# Altium project DISPLAY.PrjPcb
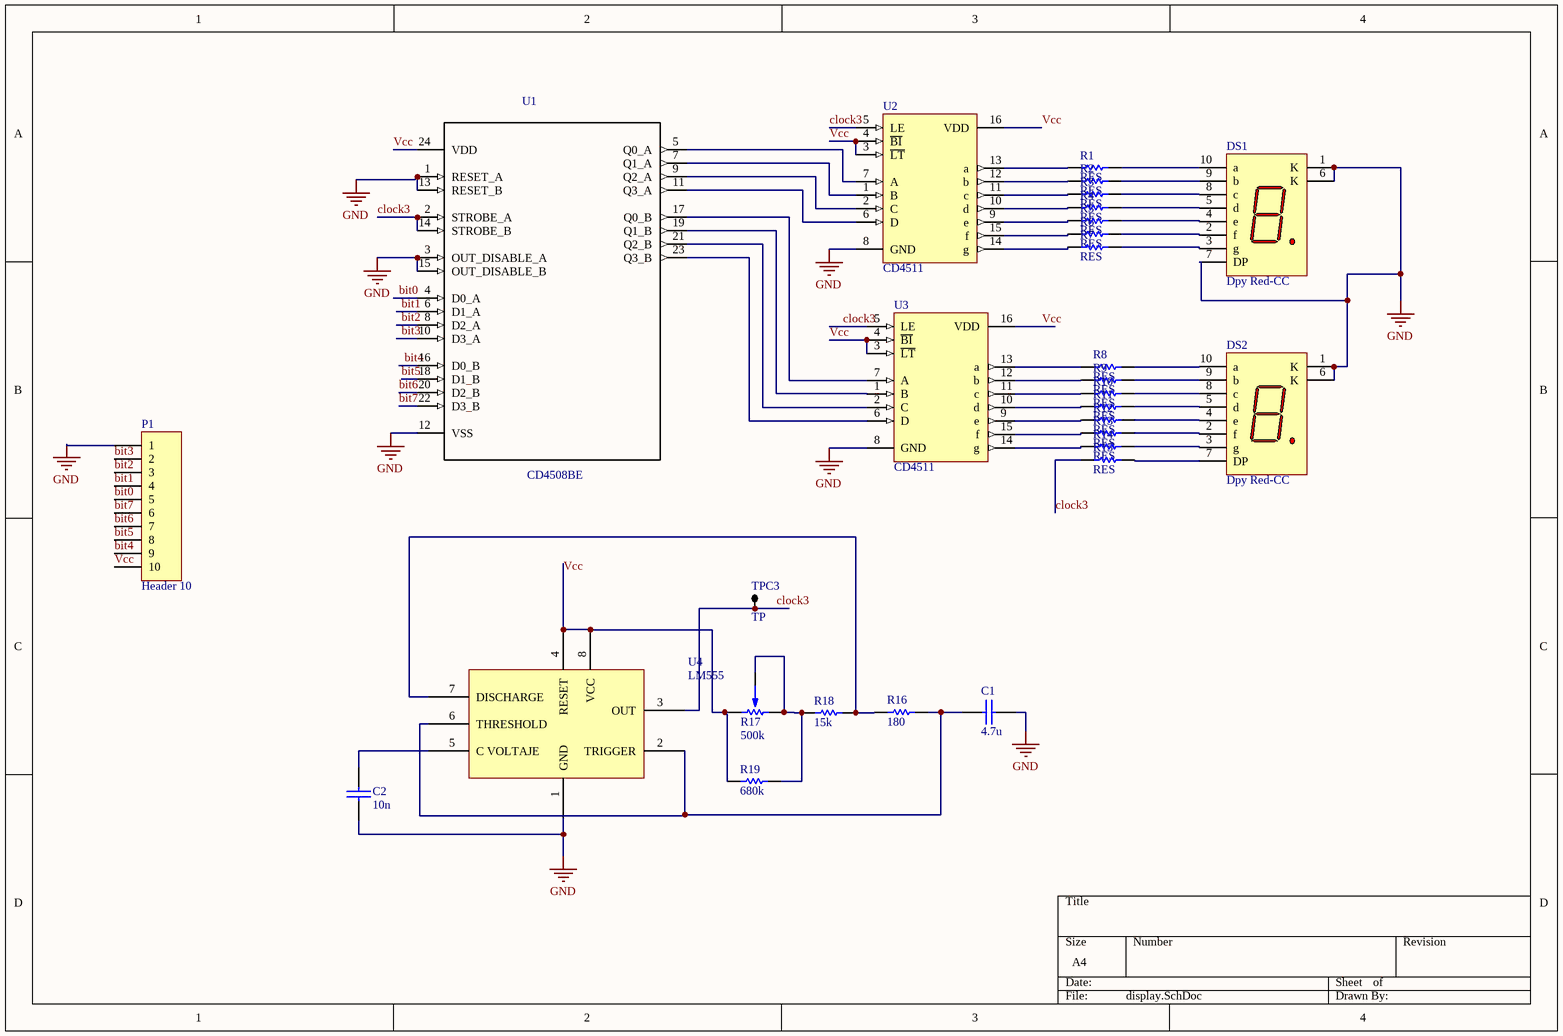
[diagram p0: display.SchDoc]
1 sheet, 29 parts. Net scope: global (net labels, ports and power ports of the same name join across sheets).
Board file: display.PcbDoc

## Sheet display.SchDoc
size A4

### Parts
C1  4.7u  [0805]
C2  10n  [CAP200]
DS1  Dpy Red-CC  [A]
DS2  Dpy Red-CC  [A]
P1  Header 10  [HDR1X10]
R1  RES  [0805]
R2  RES  [0805]
R3  RES  [0805]
R4  RES  [0805]
R5  RES  [0805]
R6  RES  [0805]
R7  RES  [0805]
R8  RES  [0805]
R9  RES  [0805]
R10  RES  [0805]
R11  RES  [0805]
R12  RES  [0805]
R13  RES  [0805]
R14  RES  [0805]
R15  RES  [0805]
R16  180  [0805]
R17  500k  [POTENCIOMETRO]
R18  15k  [0805]
R19  680k  [RES400]
TPC3  TP  [TPTH]
U1  CD4508BE  [*DIP254P1080X508-24]
U2  CD4511  [DIP16]
U3  CD4511  [DIP16]
U4  LM555  [DIP8]

### Nets
GND: C1.2 C2.1 DS1.1(K) DS1.6(K) DS1.7(DP) DS2.1(K) DS2.6(K) P1.1 U1.1(RESET_A) U1.3(OUT_DISABLE_A) U1.12(VSS) U1.13(RESET_B) U1.15(OUT_DISABLE_B) U2.8(GND) U3.8(GND) U4.1(GND)
bit0: P1.5 U1.4(D0_A)
bit1: P1.4 U1.6(D1_A)
bit2: P1.3 U1.8(D2_A)
bit3: P1.2 U1.10(D3_A)
bit4: P1.9 U1.16(D0_B)
bit5: P1.8 U1.18(D1_B)
bit6: P1.7 U1.20(D2_B)
bit7: P1.6 U1.22(D3_B)
clock3: R15.1 TPC3.1 U1.2(STROBE_A) U1.14(STROBE_B) U2.5(LE) U3.5(LE) U4.3(OUT)
Vcc: P1.10 R17.1 R19.1 U1.24(VDD) U2.3(~{LT}) U2.4(~{BI}) U2.16(VDD) U3.3(~{LT}) U3.4(~{BI}) U3.16(VDD) U4.4(RESET) U4.8(VCC)
NetC1_1: C1.1 R16.2 U4.2(TRIGGER) U4.6(THRESHOLD)
NetC2_2: C2.2 U4.5(C_VOLTAJE)
NetDS1_2: DS1.2(f) R6.2
NetDS1_3: DS1.3(g) R7.2
NetDS1_4: DS1.4(e) R5.2
NetDS1_5: DS1.5(d) R4.2
NetDS1_8: DS1.8(c) R3.2
NetDS1_9: DS1.9(b) R2.2
NetDS1_10: DS1.10(a) R1.2
NetDS2_2: DS2.2(f) R13.2
NetDS2_3: DS2.3(g) R14.2
NetDS2_4: DS2.4(e) R12.2
NetDS2_5: DS2.5(d) R11.2
NetDS2_7: DS2.7(DP) R15.2
NetDS2_8: DS2.8(c) R10.2
NetDS2_9: DS2.9(b) R9.2
NetDS2_10: DS2.10(a) R8.2
NetR1_1: R1.1 U2.13(a)
NetR2_1: R2.1 U2.12(b)
NetR3_1: R3.1 U2.11(c)
NetR4_1: R4.1 U2.10(d)
NetR5_1: R5.1 U2.9(e)
NetR6_1: R6.1 U2.15(f)
NetR7_1: R7.1 U2.14(g)
NetR8_1: R8.1 U3.13(a)
NetR9_1: R9.1 U3.12(b)
NetR10_1: R10.1 U3.11(c)
NetR11_1: R11.1 U3.10(d)
NetR12_1: R12.1 U3.9(e)
NetR13_1: R13.1 U3.15(f)
NetR14_1: R14.1 U3.14(g)
NetR16_1: R16.1 R18.2 U4.7(DISCHARGE)
NetR17_2: R17.2 R17.3 R18.1 R19.2
NetU1_5: U1.5(Q0_A) U2.7(A)
NetU1_7: U1.7(Q1_A) U2.1(B)
NetU1_9: U1.9(Q2_A) U2.2(C)
NetU1_11: U1.11(Q3_A) U2.6(D)
NetU1_17: U1.17(Q0_B) U3.7(A)
NetU1_19: U1.19(Q1_B) U3.1(B)
NetU1_21: U1.21(Q2_B) U3.2(C)
NetU1_23: U1.23(Q3_B) U3.6(D)

### Library data of the parts
C1 C2 = CAP
DS1 DS2 = Dpy Red-CC: 7.62 mm Black Surface HER 7-Segment Display: CC, RH DP; MinimumIntensity: 360 ucd; Note: IF = 5 mA; Colour: High Efficiency Red (HER); Note: Pins 1 and 6 are redundant Cathodes.; Published: 8-Jun-2000; LatestRevisionDate: 17-Dec-2003; LatestRevisionNote: Schematic revised, PCB Footprint replaced.; DatasheetVersion: 19-Feb-2002; PackageVersion: 11-Feb-2002; PackageReference: A; Publisher: Altium Limited; PackageDescription: LED, 7-Segment Display, 7.62 mm, RHD; 10 Leads; Row Space 5.08 mm; Pitch 2.54 mm; ComponentLink1Description: Manufacturer Link; ComponentLink1URL: http://www.agilent.com/
P1 = Header 10: Header, 10-Pin; LatestRevisionDate: 17-Jul-2002; LatestRevisionNote: Re-released for DXP Platform.; Publisher: Altium Limited
R16 R18 R19 = RES
R17 = POTENCIOMETRO
U1 = CD4508BE: Latch Transparent 3-ST 8-CH D-Type 24-Pin PDIP; MF: Texas Instruments; Price: None; Availability: Unavailable; SnapEDA_Link: https://www.snapeda.com/parts/CD4508BE/Texas%20Instruments/view-part/?ref=snap; Package: DIP-24 Texas Instruments; MP: CD4508BE; Value: *
U2 U3 = CD4511: BCD to 7 SEGMENTOS
U4 = LM555: Timer